# Altium schematic sheet DIOT_signal_routing.SchDoc: =DocumentName
size A4; DocumentNumber: 1; Revision: 0; SheetNumber: 9; SheetTotal: 15; Last modified by: Krzysztof Belewicz
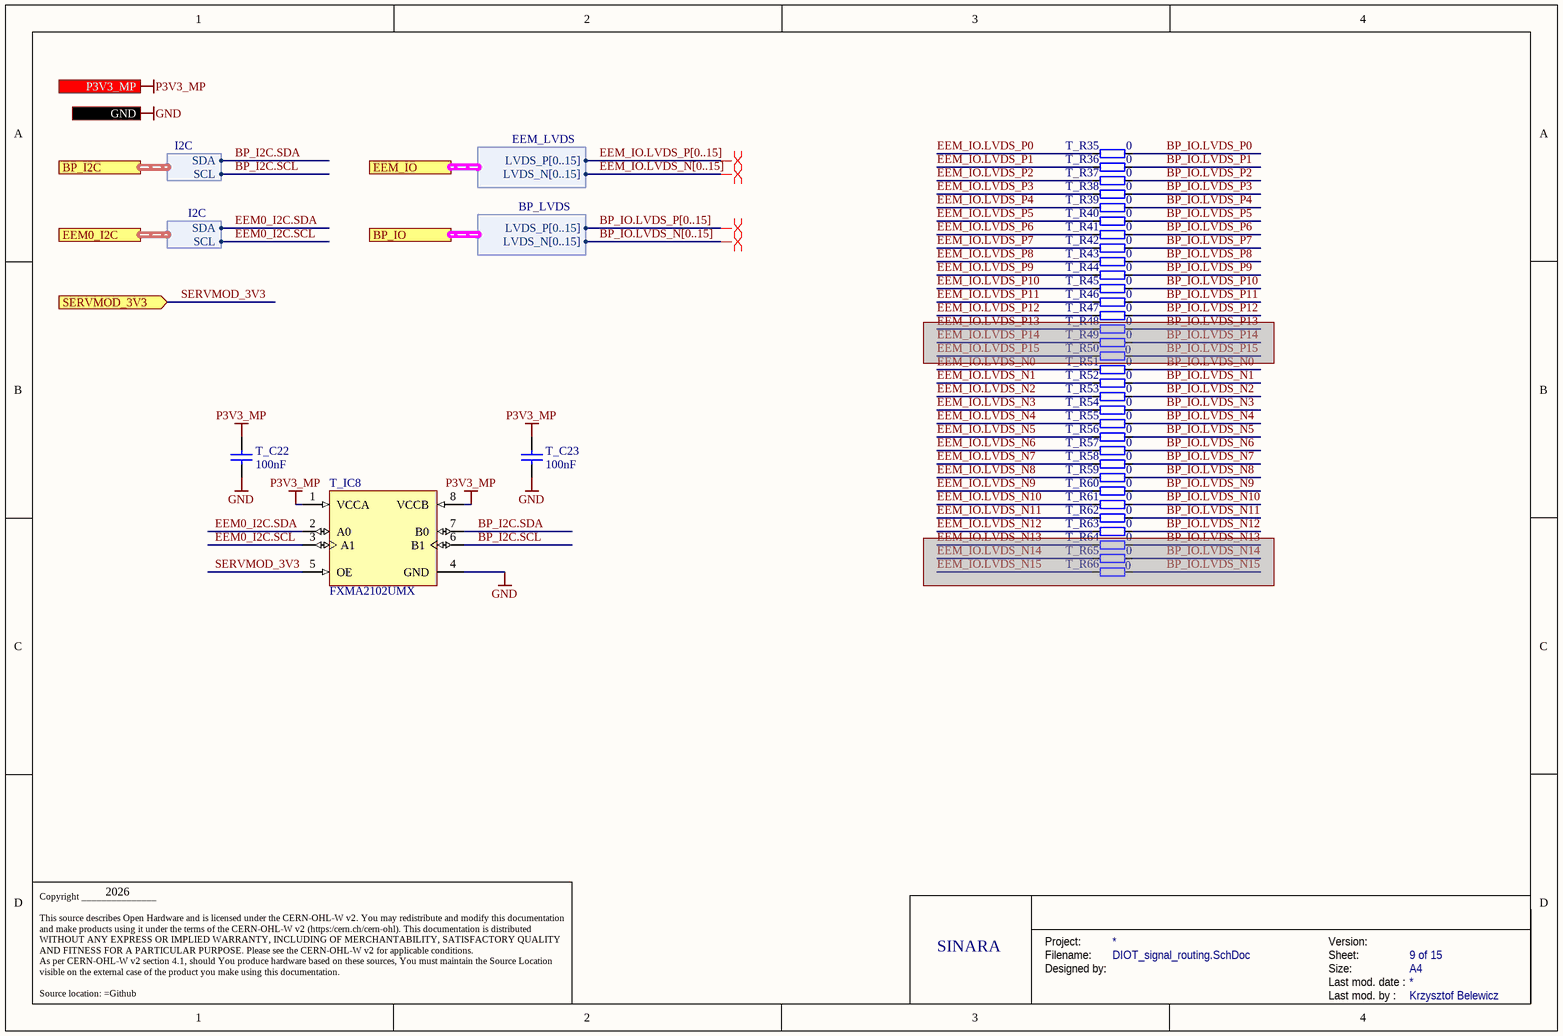
[diagram p0: DIOT_signal_routing.SchDoc]

## Parts
T_C22  100nF  [CAPC1005X55N]
T_C23  100nF  [CAPC1005X55N]
T_IC8  FXMA2102UMX  [FXMA2102UMX]
T_R35  0  [RESC1005X40N]
T_R36  0  [RESC1005X40N]
T_R37  0  [RESC1005X40N]
T_R38  0  [RESC1005X40N]
T_R39  0  [RESC1005X40N]
T_R40  0  [RESC1005X40N]
T_R41  0  [RESC1005X40N]
T_R42  0  [RESC1005X40N]
T_R43  0  [RESC1005X40N]
T_R44  0  [RESC1005X40N]
T_R45  0  [RESC1005X40N]
T_R46  0  [RESC1005X40N]
T_R47  0  [RESC1005X40N]
T_R48  0  [RESC1005X40N]  (masked out: inside a compile mask, not in the netlist)
T_R49  0  [RESC1005X40N]  (masked out: inside a compile mask, not in the netlist)
T_R50  0  [RESC1005X40N]  (masked out: inside a compile mask, not in the netlist)
T_R51  0  [RESC1005X40N]
T_R52  0  [RESC1005X40N]
T_R53  0  [RESC1005X40N]
T_R54  0  [RESC1005X40N]
T_R55  0  [RESC1005X40N]
T_R56  0  [RESC1005X40N]
T_R57  0  [RESC1005X40N]
T_R58  0  [RESC1005X40N]
T_R59  0  [RESC1005X40N]
T_R60  0  [RESC1005X40N]
T_R61  0  [RESC1005X40N]
T_R62  0  [RESC1005X40N]
T_R63  0  [RESC1005X40N]
T_R64  0  [RESC1005X40N]  (masked out: inside a compile mask, not in the netlist)
T_R65  0  [RESC1005X40N]  (masked out: inside a compile mask, not in the netlist)
T_R66  0  [RESC1005X40N]  (masked out: inside a compile mask, not in the netlist)

## Ports
BP_I2C (harness I2C), BP_IO (harness BP_LVDS), EEM0_I2C (harness I2C), EEM_IO (harness EEM_LVDS), GND, P3V3_MP (in), SERVMOD_3V3 (in)

## Harnesses
I2C: SDA, SCL
EEM_LVDS: LVDS_P[0..15], LVDS_N[0..15]
BP_LVDS: LVDS_P[0..15], LVDS_N[0..15]

## Nets
GND: T_C22.1 T_C23.1 T_IC8.4(GND) ; port GND
P3V3_MP: T_C22.2 T_C23.2 T_IC8.1(VCCA) T_IC8.8(VCCB) ; port P3V3_MP
BP_I2C.SCL: T_IC8.6(B1) ; port BP_I2C.SCL
BP_I2C.SDA: T_IC8.7(B0) ; port BP_I2C.SDA
BP_IO.LVDS_N0: T_R51.1
BP_IO.LVDS_N1: T_R52.1
BP_IO.LVDS_N2: T_R53.1
BP_IO.LVDS_N3: T_R54.1
BP_IO.LVDS_N4: T_R55.1
BP_IO.LVDS_N5: T_R56.1
BP_IO.LVDS_N6: T_R57.1
BP_IO.LVDS_N7: T_R58.1
BP_IO.LVDS_N8: T_R59.1
BP_IO.LVDS_N9: T_R60.1
BP_IO.LVDS_N10: T_R61.1
BP_IO.LVDS_N11: T_R62.1
BP_IO.LVDS_N12: T_R63.1
BP_IO.LVDS_P0: T_R35.1
BP_IO.LVDS_P1: T_R36.1
BP_IO.LVDS_P2: T_R37.1
BP_IO.LVDS_P3: T_R38.1
BP_IO.LVDS_P4: T_R39.1
BP_IO.LVDS_P5: T_R40.1
BP_IO.LVDS_P6: T_R41.1
BP_IO.LVDS_P7: T_R42.1
BP_IO.LVDS_P8: T_R43.1
BP_IO.LVDS_P9: T_R44.1
BP_IO.LVDS_P10: T_R45.1
BP_IO.LVDS_P11: T_R46.1
BP_IO.LVDS_P12: T_R47.1
EEM0_I2C.SCL: T_IC8.3(A1) ; port EEM0_I2C.SCL
EEM0_I2C.SDA: T_IC8.2(A0) ; port EEM0_I2C.SDA
EEM_IO.LVDS_N0: T_R51.2
EEM_IO.LVDS_N1: T_R52.2
EEM_IO.LVDS_N2: T_R53.2
EEM_IO.LVDS_N3: T_R54.2
EEM_IO.LVDS_N4: T_R55.2
EEM_IO.LVDS_N5: T_R56.2
EEM_IO.LVDS_N6: T_R57.2
EEM_IO.LVDS_N7: T_R58.2
EEM_IO.LVDS_N8: T_R59.2
EEM_IO.LVDS_N9: T_R60.2
EEM_IO.LVDS_N10: T_R61.2
EEM_IO.LVDS_N11: T_R62.2
EEM_IO.LVDS_N12: T_R63.2
EEM_IO.LVDS_P0: T_R35.2
EEM_IO.LVDS_P1: T_R36.2
EEM_IO.LVDS_P2: T_R37.2
EEM_IO.LVDS_P3: T_R38.2
EEM_IO.LVDS_P4: T_R39.2
EEM_IO.LVDS_P5: T_R40.2
EEM_IO.LVDS_P6: T_R41.2
EEM_IO.LVDS_P7: T_R42.2
EEM_IO.LVDS_P8: T_R43.2
EEM_IO.LVDS_P9: T_R44.2
EEM_IO.LVDS_P10: T_R45.2
EEM_IO.LVDS_P11: T_R46.2
EEM_IO.LVDS_P12: T_R47.2
SERVMOD_3V3: T_IC8.5(OE) ; port SERVMOD_3V3

## Buses and harness runs
bus BP_IO.LVDS_N[0..15]
bus BP_IO.LVDS_P[0..15]
bus EEM_IO.LVDS_N[0..15]
bus EEM_IO.LVDS_P[0..15]

## Layout directives
differential pair; differential pair class Diff_100Ohm: (no net found under the mark)
differential pair: (no net found under the mark)

## Notes on the sheet
- 2026
- SINARA
- Project:
- Designed by:
- Filename:
- Size:
- Version:
- Last mod. date :
- Sheet:
- A4
- Copyright _______________
  This source describes Open Hardware and is licensed under the CERN-OHL-W v2. You may redistribute and modify this documentation and make products using it under the terms of the CERN-OHL-W v2 (https:/cern.ch/cern-ohl). This documentation is distributed WITHOUT ANY EXPRESS OR IMPLIED WARRANTY, INCLUDING OF MERCHANTABILITY, SATISFACTORY QUALITY AND FITNESS FOR A PARTICULAR PURPOSE. Please see the CERN-OHL-W v2 for applicable conditions.
  As per CERN-OHL-W v2 section 4.1, should You produce hardware based on these sources, You must maintain the Source Location visible on the external case of the product you make using this documentation.
  Source location: =Github
- Last mod. by :

## Library data of the parts
T_C22 T_C23 = CC0402_100NF_50V_10%_X7R: Non-polarised capacitor; Part Description: SMD Multilayer Chip Ceramic Capacitor; Manufacturer: GENERIC; Manufacturer1 Part Number: GRM155R71H104KE14D; Voltage: 50V; TC: X7R; Tolerance: ±10%; Part Number: CC0402_100NF_50V_10%_X7R; Component Kind: Standard; Component Type: Standard; Pin Count: 2; Value: 100nF; Status: None; Manufacturer Part Number: CC0402_100NF_50V_10%_X7R; Case: 0402; Mounted: Yes; Socket: No; SMD: Yes; Sense: No; HelpURL: \\cern.ch\dfs\Applications\Altium\Datasheets\CC0402_MURATA_GRM155R71H104KE14D.pdf; Author: CERN DEM MR; CreateDate: 30.06.2017; LatestRevisionDate: 30.06.2017; Manufacturer1 Example: MURATA; Manufacturer1 ComponentHeight: 0.55mm
T_IC8 = CMP-015-00014-1: Dual Supply 2-Bit Voltage Translator/Buffer/Repeater Isolator for I2C Applications; Manufacturer: Onsemi; Max Supply Voltage: 5.5V; Min Supply Voltage: 1.65V; Min Operating Temperature: -40°C; Pins: 8; Max Operating Temperature: 85°C; Manufacaturer Part Number: FXMA2102UMX; Mounting Technology: Surface Mount
T_R35-T_R66 = R0402_0R_JUMPER: Resistor; Part Description: 1A (0.05R Max DC Resistance) Zero Ohm Jumper; Manufacturer: GENERIC; Manufacturer1 Part Number: 232270591001L; PressFit: No; Part Number: R0402_0R_JUMPER; Component Kind: Standard; Component Type: Standard; Pin Count: 2; Value: 0; Status: Not Recommended; Manufacturer Part Number: R0402_0R_JUMPER; Case: 0402; Mounted: Yes; Sense: No; Socket: No; SMD: Yes; Manufacturer1 Example: YAGEO PHYCOMP; Manufacturer1 ComponentHeight: 0.4mm; HelpURL: \\cern.ch\dfs\Applications\Altium\Datasheets\R0402_Phycomp_RC0402.pdf; Author: CERN DEM JLC; CreateDate: 03.12.2007; LatestRevisionDate: 17.10.2012